# Altium schematic sheet PSFB_power.SchDoc
size 420 x 297 mm
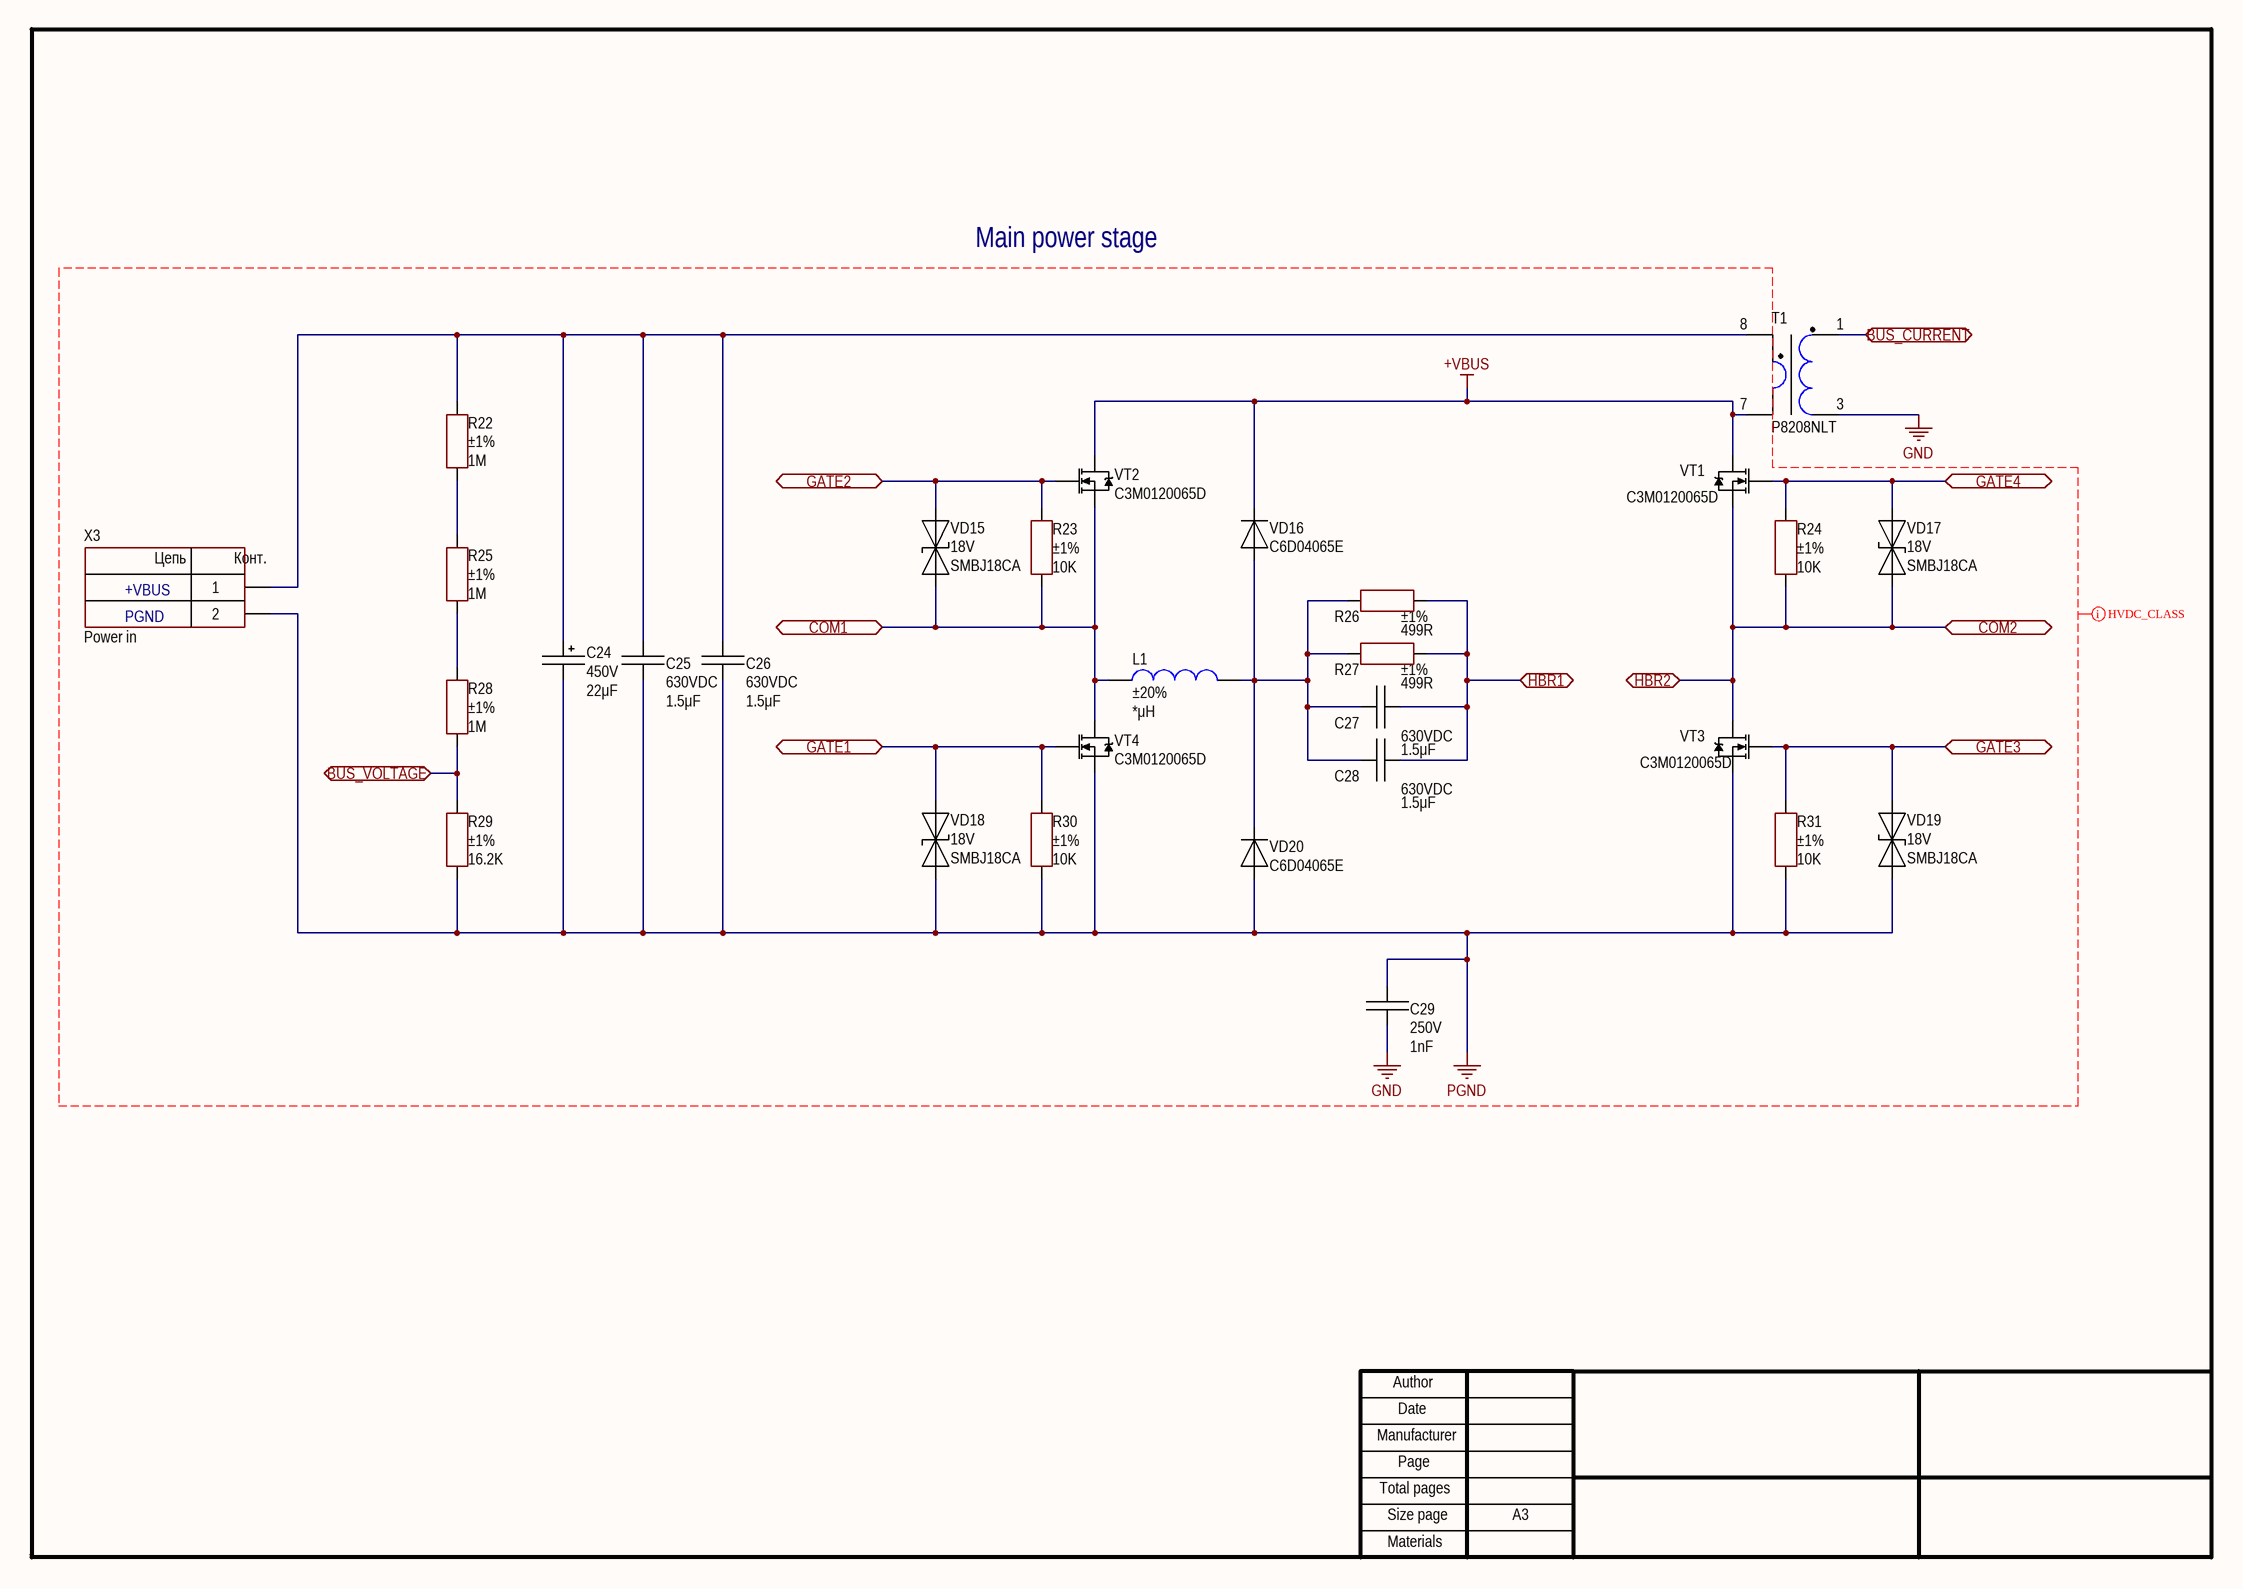
[diagram p0: PSFB_power.SchDoc]

## Parts
C24  value 22μF  Voltage: 450V  [CAP: D16C7.5H25]
C25  value 1.5μF  Voltage: 630VDC  [WCAP-FTBP_L31W16H25.5]
C26  value 1.5μF  Voltage: 630VDC  [WCAP-FTBP_L31W16H25.5]
C27  value 1.5μF  Voltage: 630VDC  [WCAP-FTBP_L31W16H25.5]
C28  value 1.5μF  Voltage: 630VDC  [WCAP-FTBP_L31W16H25.5]
C29  value 1nF  Voltage: 250V  [WCAP-CSSA_2211_H2.5]
L1  value *μH  Tolerance: ±20%  [IND: R26.9/14.7/11.2 (H)]
R22  value 1M  Tolerance: ±1%  [RES: 1206]
R23  value 10K  Tolerance: ±1%  [RES: 0805]
R24  value 10K  Tolerance: ±1%  [RES: 0805]
R25  value 1M  Tolerance: ±1%  [RES: 1206]
R26  value 499R  Tolerance: ±1%  [RES: 2512]
R27  value 499R  Tolerance: ±1%  [RES: 2512]
R28  value 1M  Tolerance: ±1%  [RES: 1206]
R29  value 16.2K  Tolerance: ±1%  [RES: 1206]
R30  value 10K  Tolerance: ±1%  [RES: 0805]
R31  value 10K  Tolerance: ±1%  [RES: 0805]
T1  PartNumber: P8208NLT  [TRANS: P8208NLT]
VD15  Voltage: 18V  PartNumber: SMBJ18CA  [DIODE: SMB]
VD16  PartNumber: C6D04065E  [DPAK (D)]
VD17  Voltage: 18V  PartNumber: SMBJ18CA  [DIODE: SMB]
VD18  Voltage: 18V  PartNumber: SMBJ18CA  [DIODE: SMB]
VD19  Voltage: 18V  PartNumber: SMBJ18CA  [DIODE: SMB]
VD20  PartNumber: C6D04065E  [DPAK (D)]
VT1  PartNumber: C3M0120065D  [TO247(H)]
VT2  PartNumber: C3M0120065D  [TO247(H)]
VT3  PartNumber: C3M0120065D  [TO247(H)]
VT4  PartNumber: C3M0120065D  [TO247(H)]
X3  CommentText: Power in  [CON: 2453690000]

## Ports
BUS_CURRENT (bidir), BUS_VOLTAGE (bidir), COM1 (bidir), COM2 (bidir), GATE1 (bidir), GATE2 (bidir), GATE3 (bidir), GATE4 (bidir), HBR1 (bidir), HBR2 (bidir)

## Nets
+VBUS: T1.7 VD16.2 VT1.2(D) VT2.2(D)
GND: C29.2 T1.3
PGND: C24.2 C25.1 C26.1 C29.1 R29.1 R30.1 R31.1 VD18.2(C) VD19.2(C) VD20.1 VT3.3(S) VT4.3(S) X3.2
BUS_CURRENT: T1.1 ; port BUS_CURRENT
BUS_VOLTAGE: R28.1 R29.2 ; port BUS_VOLTAGE
COM1: L1.2 R23.1 VD15.2(C) VT2.3(S) VT4.2(D) ; port COM1
COM2: R24.1 VD17.2(C) VT1.3(S) VT3.2(D) ; port COM2, port HBR2
GATE1: R30.2 VD18.1(A) VT4.1(G) ; port GATE1
GATE2: R23.2 VD15.1(A) VT2.1(G) ; port GATE2
GATE3: R31.2 VD19.1(A) VT3.1(G) ; port GATE3
GATE4: R24.2 VD17.1(A) VT1.1(G) ; port GATE4
HBR1: C27.2 C28.2 R26.2 R27.2 ; port HBR1
NetC24_1: C24.1 C25.2 C26.2 R22.2 T1.8 X3.1
NetC27_1: C27.1 C28.1 L1.1 R26.1 R27.1 VD16.1 VD20.2
NetR22_1: R22.1 R25.2
NetR25_1: R25.1 R28.2

## Layout directives
net class HVDC_CLASS: +VBUS, GND, PGND

## Notes on the sheet
- Main power stage
- +VBUS
- PGND
- Author
- Manufacturer
- Date
- Page
- Total pages
- Size page
- A3
- Materials
- (in symbol LUF-10.00) Цепь; Конт.

## Library data of the parts
C24 = Aluminium: 22µF 450V Aluminum Electrolytic Capacitors Radial, Can  12000 Hrs @ 105°C; Manufacturer: Rubycon; PartNumber: A750KS337M1EAAE018; TypeCapacitor: Aluminium capacitor; Tolerance: ±20%; Package: 13x8x3.5 mm; HelpURL: https://www.digikey.com/en/products/detail/rubycon/450BXC22MEFC16X20/3564354; ValueManufacturerPartNumber: =TypeCapacitor+', '+Value+', '+Voltage+', '+Tolerance+', '+Impedance+', '+Package+', '+Temperature; Temperature: -55...+105°C
C25-C28 = Film: 1.5µF Film Capacitor  630V Polypropylene (PP), Metallized RadialC; Manufacturer: Würth Elektronik; PartNumber: 890303327008CS; ValueManufacturerPartNumber: Film capacitor, 1.5μF, 630VDC, ±10%, 22mOhm, 31x16x26.5mm, -40...+105°C; Tolerance: ±10%; Impedance: 22mOhm; Package: 31x16x26.5mm; HelpURL: https://www.digikey.com/en/products/detail/w%C3%BCrth-elektronik/890303327008CS/8324661; Temperature: -40...+105°C; TypeCapacitor: Film capacitor
C29 = Ceramic_2211: 1000pF ±10% 250V Ceramic Capacitor X7R 2211 (5728 Metric); Manufacturer: Yageo; PartNumber: 8853522130111; ValueManufacturerPartNumber: Ceramic capacitor, 1nF, X7R, ±10%, 250V, 2211, -55...+125°C; Package: 2211; HelpURL: https://www.digikey.com/en/products/detail/w%C3%BCrth-elektronik/8853522130111/6140841; Temperature: -55...+125°C; TypeCapacitor: Ceramic capacitor; Tolerance: ±10%; TypeDielectric: X7R
L1 = Inductor_R26.9/14.7/11.2: Custom inductor, DNP; Manufacturer: Magnetics; PartNumber: 0077930A7; ValueManufacturerPartNumber: Fixed inductor, *μH, ±20%, R26.9/14.7/11.2, Kool Mu, µ=125, 157 нГн/витков2; TypeInductor: Fixed inductor; TypeMatiriel: Kool Mu; AL: 157 нГн/витков2; MaterialPermeability: µ=125; Package: R26.9/14.7/11.2; HelpURL: http://ferrite.ru/warehouse/r-26-914-711-2-77930-a7.html
R22 R25 R28 = Resistor_1206: 1 MOhms ±1% 0.25W, 1/4W Chip Resistor 1206 (3216 Metric) Moisture Resistant Thick Film; Manufacturer: Yageo; PartNumber: RC1206FR-071ML; ValueManufacturerPartNumber: Resistor film, 1M, ±1%, 1206, 0.25W, -55...+125°C; TypeResistor: Resistor film; Package: 1206; HelpURL: https://www.digikey.com/en/products/detail/yageo/RC1206FR-071ML/728388; Temperature: -55...+125°C; Power: 0.25W
R23 R24 R30 R31 = Resistor_0805: 10 kOhms ±1% 0.125W, 1/8W Chip Resistor 0805 (2012 Metric) Moisture Resistant Thick Film; Manufacturer: Yageo; PartNumber: RC0805FR-0710KL; ValueManufacturerPartNumber: Resistor film, 10K, ±1%, 0805, 0.125W, -55...+125°C; TypeResistor: Resistor film; Package: 0805; HelpURL: https://www.digikey.com/en/products/detail/yageo/RC0805FR-0710KL/727535; Temperature: -55...+125°C; Power: 0.125W
R26 R27 = Resistor_2512: 499 Ohms ±1% 1W Chip Resistor 2512 (6432 Metric) Moisture Resistant Thick Film; Manufacturer: Yageo; PartNumber: RC2512FK-07499RL; ValueManufacturerPartNumber: Resistor film, 499R, ±1%, 2512, 1W, -55...+125°C; TypeResistor: Resistor film; Package: 2512; HelpURL: https://www.digikey.com/en/products/detail/yageo/RC2512FK-07499RL/5922242; Temperature: -55...+125°C; Power: 1W
R29 = Resistor_1206: 16.2 kOhms ±1% 0.25W, 1/4W Chip Resistor 1206 (3216 Metric) Moisture Resistant Thick Film; Manufacturer: Yageo; PartNumber: RC1206FR-0716K2L; ValueManufacturerPartNumber: Resistor film, 16.2K, ±1%, 1206, 0.25W, -55...+125°C; TypeResistor: Resistor film; Package: 1206; HelpURL: https://www.digikey.com/en/products/detail/yageo/RC1206FR-0716K2L/728570; Temperature: -55...+125°C; Power: 0.25W
T1 = Current_P8208NLT: 1:100 Current Sense Transformer 50kHz ~ 1MHz 6mOhm Primary, 5.5Ohm Secondary 2mH Surface Mount; Manufacturer: Pulse Electronics; ValueManufacturerPartNumber: Current transformer, 1:100, 50...1000 kHz; TypeTransformer: Current transformer; Power: 50...1000 kHz; HelpURL: https://www.digikey.com/product-detail/en/pulse-electronics-power/P8208NLT/553-1523-1-ND/2362921; Voltage: 1:100
VD15 VD17-VD19 = TVS_single: 29.2V Clamp 20.6A Ipp Tvs Diode Surface Mount DO-214AA (SMBJ); Manufacturer: Diodes Incorporated; Current: 600W; Package: SMB; HelpURL: https://www.digikey.com/en/products/detail/littelfuse-inc/SMBJ18CA/285986; ValueManufacturerPartNumber: =TypeDiode+', '+Voltage+', '+Current+', '+VoltageDrop+', '+RecoveryTime+', '+Package+', '+Temperature; Temperature: -55...+150°C; TypeDiode: TVS diode
VD16 VD20 = Diode_single: Diode Silicon Carbide Schottky 650V 8A (DC) Surface Mount TO-252-2; Manufacturer: Wolfspeed; ValueManufacturerPartNumber: Single diode, 650V, 1A, 1.5V, 0ns, TO-252-2, -55...+150°C; TypeDiode: Single diode; Current: 1A; VoltageDrop: 1.5V; RecoveryTime: 0ns; Package: TO-252-2; HelpURL: https://www.digikey.com/en/products/detail/cree-wolfspeed/C6D04065E/12525322; Temperature: -55...+150°C; Voltage: 650V
VT1-VT4 = MOSFET_N_123: N-Channel 650V 22A (Tc) 98W (Tc) SiC MOSFET Through Hole TO-247-3; Manufacturer: Infineon Technologies; ValueManufacturerPartNumber: MOSFET N-channel transistor, 650V, 22A, 26nC, 98W, 120mOhm, 756pF, TO247-3, -55...+150°C; TypeTransistor: MOSFET N-channel transistor; RDS: 120mOhm; GateCharge: 26nC; InputCapacitor: 756pF; Package: TO247-3; HelpURL: https://www.richardsonrfpd.com/Products/Product/C3M0120065D; Temperature: -55...+150°C; VoltageDS: 650V; CurrentDS: 22A; MaxPower: 98W
X3 = LUF-10.00: 2 Position Wire to Board Terminal Block Horizontal with Board 0.394" (10.00mm) Through Hole; Manufacturer: Weidmüller; ValueManufacturerPartNumber: Connector, 2pin, 10mm, 600V, 60A; PartNumber: 2453690000; TypeConnector: Connector; VoltageMax: 600V; Pitch: 10mm; CurrentMax: 60A; Multichannel: 2pin; HelpURL: https://www.digikey.com/en/products/detail/weidm%C3%BCller/2453690000/9637690